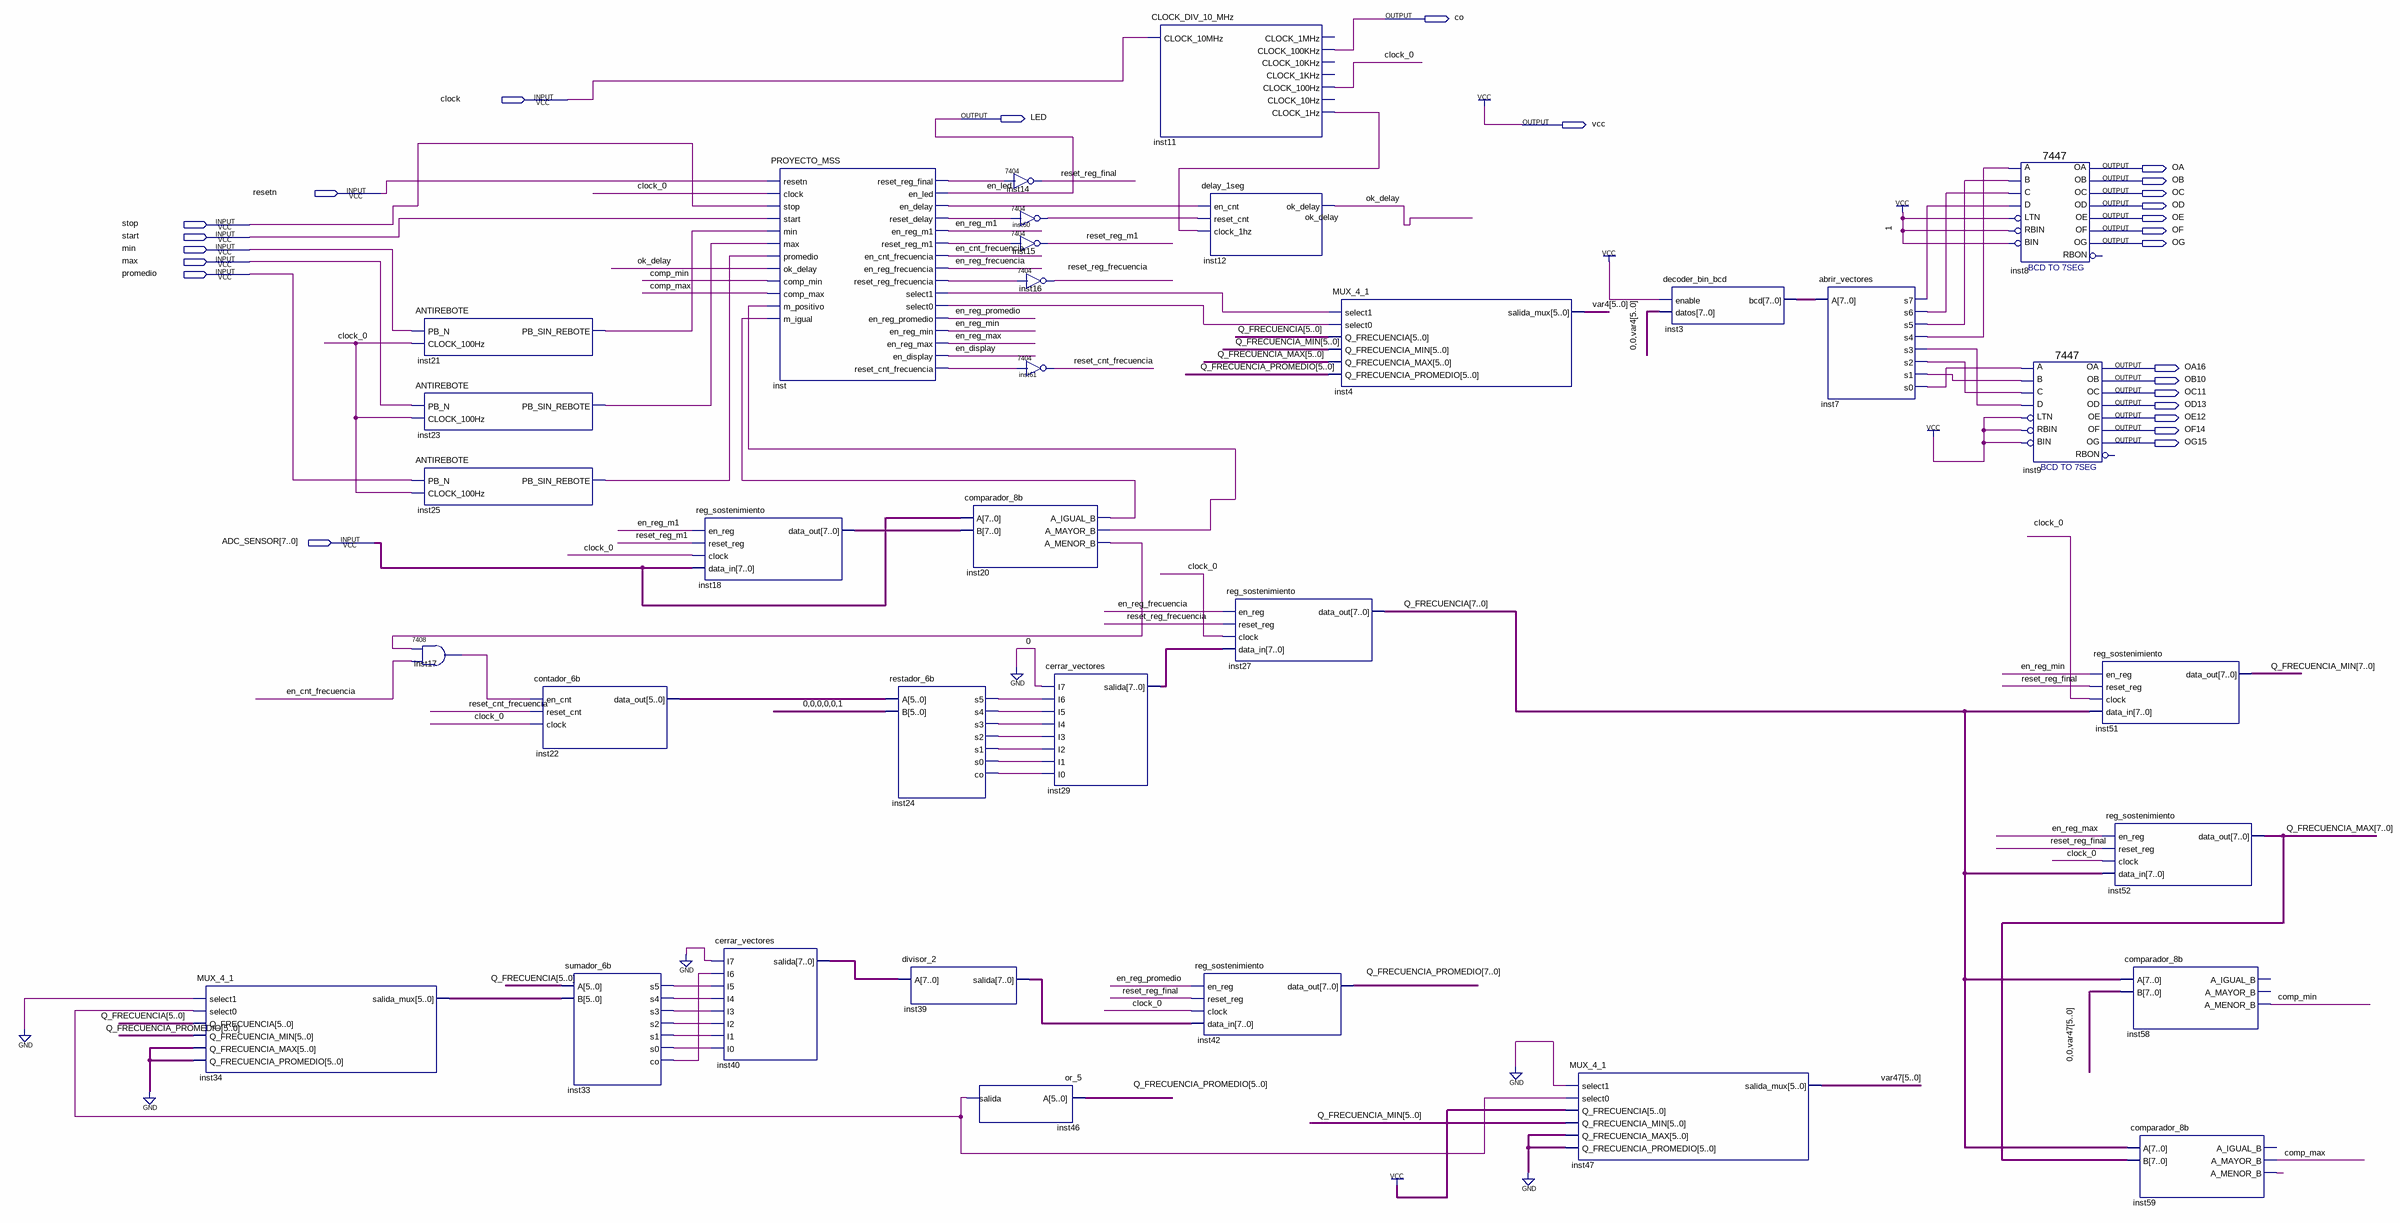
[diagram p0: schematic sheet]
// Quartus schematic simulacion_1.bdf as structural Verilog: 34 symbols, 25 pins
module simulacion_1 (
  input  clock,
  input  resetn,
  input  stop,
  input  start,
  input  min,
  input  max,
  input  promedio,
  input  [7:0] ADC_SENSOR,
  output co,
  output LED,
  output vcc,
  output OA,
  output OB,
  output OC,
  output OD,
  output OE,
  output OF,
  output OG,
  output OA16,
  output OB10,
  output OC11,
  output OD13,
  output OE12,
  output OF14,
  output OG15
);

  wire clock_0, comp_max, comp_min, en_cnt_frecuencia, en_display, en_reg_frecuencia, en_reg_m1, en_reg_max,
       en_reg_min, en_reg_promedio, inst7_s0, inst7_s1, inst7_s2, inst7_s3, inst7_s4, inst7_s5, inst7_s6,
       inst7_s7, inst11_clock_1hz, inst17_1, inst20_a_igual_b, inst20_a_mayor_b, inst20_a_menor_b,
       inst21_pb_sin_rebote, inst23_pb_sin_rebote, inst24_co, inst24_s0, inst24_s1, inst24_s2, inst24_s3,
       inst24_s4, inst24_s5, inst25_pb_sin_rebote, inst33_co, inst33_s0, inst33_s1, inst33_s2, inst33_s3,
       inst33_s4, inst33_s5, inst46_salida, inst59_a_menor_b, inst60_1, inst_en_delay,
       inst_reset_cnt_frecuencia, inst_reset_delay, inst_reset_reg_final, inst_reset_reg_frecuencia,
       inst_reset_reg_m1, inst_select0, inst_select1, ok_delay, reset_cnt_frecuencia, reset_reg_final,
       reset_reg_frecuencia, reset_reg_m1;
  wire [5:0] inst22_data_out, inst34_salida_mux, var4, var47;
  wire [7:0] inst3_bcd, inst18_data_out, inst29_salida, inst39_salida, inst40_salida, Q_FRECUENCIA,
       Q_FRECUENCIA_MAX, Q_FRECUENCIA_MIN, Q_FRECUENCIA_PROMEDIO;

  MUX_4_1 inst34 (
    .select1(1'b0), .select0(inst46_salida), .Q_FRECUENCIA(Q_FRECUENCIA[5:0]),
    .Q_FRECUENCIA_MIN(Q_FRECUENCIA_PROMEDIO[5:0]), .Q_FRECUENCIA_MAX({6{1'b0}}),
    .Q_FRECUENCIA_PROMEDIO({6{1'b0}}), .salida_mux(inst34_salida_mux));
  ANTIREBOTE inst21 (.PB_N(min), .CLOCK_100Hz(clock_0), .PB_SIN_REBOTE(inst21_pb_sin_rebote));
  ANTIREBOTE inst23 (.PB_N(max), .CLOCK_100Hz(clock_0), .PB_SIN_REBOTE(inst23_pb_sin_rebote));
  ANTIREBOTE inst25 (.PB_N(promedio), .CLOCK_100Hz(clock_0), .PB_SIN_REBOTE(inst25_pb_sin_rebote));
  \7408  inst17 (.\3 (en_cnt_frecuencia), .\2 (inst20_a_menor_b), .\1 (inst17_1));
  contador_6b inst22 (.en_cnt(inst17_1), .reset_cnt(reset_cnt_frecuencia), .clock(clock_0), .data_out(inst22_data_out));
  sumador_6b inst33 (
    .A(Q_FRECUENCIA[5:0]), .B(inst34_salida_mux), .s5(inst33_s5), .s4(inst33_s4), .s3(inst33_s3),
    .s2(inst33_s2), .s1(inst33_s1), .s0(inst33_s0), .co(inst33_co));
  reg_sostenimiento inst18 (
    .en_reg(en_reg_m1), .reset_reg(reset_reg_m1), .clock(clock_0), .data_in(ADC_SENSOR),
    .data_out(inst18_data_out));
  cerrar_vectores inst40 (
    .I7(1'b0), .I6(inst33_co), .I5(inst33_s5), .I4(inst33_s4), .I3(inst33_s3), .I2(inst33_s2),
    .I1(inst33_s1), .I0(inst33_s0), .salida(inst40_salida));
  PROYECTO_MSS inst (
    .resetn(resetn), .clock(clock_0), .stop(stop), .start(start), .min(inst21_pb_sin_rebote),
    .max(inst23_pb_sin_rebote), .promedio(inst25_pb_sin_rebote), .ok_delay(ok_delay), .comp_min(comp_min),
    .comp_max(comp_max), .m_positivo(inst20_a_mayor_b), .m_igual(inst20_a_igual_b),
    .reset_reg_final(inst_reset_reg_final), .en_led(LED), .en_delay(inst_en_delay),
    .reset_delay(inst_reset_delay), .en_reg_m1(en_reg_m1), .reset_reg_m1(inst_reset_reg_m1),
    .en_cnt_frecuencia(en_cnt_frecuencia), .en_reg_frecuencia(en_reg_frecuencia),
    .reset_reg_frecuencia(inst_reset_reg_frecuencia), .select1(inst_select1), .select0(inst_select0),
    .en_reg_promedio(en_reg_promedio), .en_reg_min(en_reg_min), .en_reg_max(en_reg_max),
    .en_display(en_display), .reset_cnt_frecuencia(inst_reset_cnt_frecuencia));
  restador_6b inst24 (
    .A(inst22_data_out), .B(6'b000001), .s5(inst24_s5), .s4(inst24_s4), .s3(inst24_s3), .s2(inst24_s2),
    .s1(inst24_s1), .s0(inst24_s0), .co(inst24_co));
  divisor_2 inst39 (.A(inst40_salida), .salida(inst39_salida));
  \7404  inst14 (.\2 (inst_reset_reg_final), .\1 (reset_reg_final));
  comparador_8b inst20 (
    .A(ADC_SENSOR), .B(inst18_data_out), .A_IGUAL_B(inst20_a_igual_b), .A_MAYOR_B(inst20_a_mayor_b),
    .A_MENOR_B(inst20_a_menor_b));
  or_5 inst46 (.A(Q_FRECUENCIA_PROMEDIO[5:0]), .salida(inst46_salida));
  \7404  inst60 (.\2 (inst_reset_delay), .\1 (inst60_1));
  \7404  inst15 (.\2 (inst_reset_reg_m1), .\1 (reset_reg_m1));
  \7404  inst16 (.\2 (inst_reset_reg_frecuencia), .\1 (reset_reg_frecuencia));
  \7404  inst61 (.\2 (inst_reset_cnt_frecuencia), .\1 (reset_cnt_frecuencia));
  cerrar_vectores inst29 (
    .I7(1'b0), .I6(inst24_s5), .I5(inst24_s4), .I4(inst24_s3), .I3(inst24_s2), .I2(inst24_s1),
    .I1(inst24_s0), .I0(inst24_co), .salida(inst29_salida));
  CLOCK_DIV_10_MHz inst11 (
    .CLOCK_10MHz(clock), .CLOCK_100KHz(co), .CLOCK_100Hz(clock_0), .CLOCK_1Hz(inst11_clock_1hz));  // open: CLOCK_1MHz, CLOCK_10KHz, CLOCK_1KHz, CLOCK_10Hz
  delay_1seg inst12 (.en_cnt(inst_en_delay), .reset_cnt(inst60_1), .clock_1hz(inst11_clock_1hz), .ok_delay(ok_delay));
  reg_sostenimiento inst42 (
    .en_reg(en_reg_promedio), .reset_reg(reset_reg_final), .clock(clock_0), .data_in(inst39_salida),
    .data_out(Q_FRECUENCIA_PROMEDIO));
  reg_sostenimiento inst27 (
    .en_reg(en_reg_frecuencia), .reset_reg(reset_reg_frecuencia), .clock(clock_0), .data_in(inst29_salida),
    .data_out(Q_FRECUENCIA));
  MUX_4_1 inst4 (
    .select1(inst_select1), .select0(inst_select0), .Q_FRECUENCIA(Q_FRECUENCIA[5:0]),
    .Q_FRECUENCIA_MIN(Q_FRECUENCIA_MIN[5:0]), .Q_FRECUENCIA_MAX(Q_FRECUENCIA_MAX[5:0]),
    .Q_FRECUENCIA_PROMEDIO(Q_FRECUENCIA_PROMEDIO[5:0]), .salida_mux(var4));
  MUX_4_1 inst47 (
    .select1(1'b0), .select0(inst46_salida), .Q_FRECUENCIA({6{1'b1}}),
    .Q_FRECUENCIA_MIN(Q_FRECUENCIA_MIN[5:0]), .Q_FRECUENCIA_MAX({6{1'b0}}),
    .Q_FRECUENCIA_PROMEDIO({6{1'b0}}), .salida_mux(var47));
  decoder_bin_bcd inst3 (.enable(1'b1), .datos({2'b00, var4}), .bcd(inst3_bcd));
  abrir_vectores inst7 (
    .A(inst3_bcd), .s7(inst7_s7), .s6(inst7_s6), .s5(inst7_s5), .s4(inst7_s4), .s3(inst7_s3), .s2(inst7_s2),
    .s1(inst7_s1), .s0(inst7_s0));
  \7447  inst8 (
    .LTN(1'b1), .B(inst7_s5), .C(inst7_s6), .D(inst7_s7), .RBIN(1'b1), .BIN(1'b1), .A(inst7_s4), .OB(OB),
    .OC(OC), .OE(OE), .OD(OD), .OF(OF), .OG(OG), .OA(OA));  // open: RBON
  \7447  inst9 (
    .LTN(1'b1), .B(inst7_s1), .C(inst7_s2), .D(inst7_s3), .RBIN(1'b1), .BIN(1'b1), .A(inst7_s0), .OB(OB10),
    .OC(OC11), .OE(OE12), .OD(OD13), .OF(OF14), .OG(OG15), .OA(OA16));  // open: RBON
  reg_sostenimiento inst51 (
    .en_reg(en_reg_min), .reset_reg(reset_reg_final), .clock(clock_0), .data_in(Q_FRECUENCIA),
    .data_out(Q_FRECUENCIA_MIN));
  reg_sostenimiento inst52 (
    .en_reg(en_reg_max), .reset_reg(reset_reg_final), .clock(clock_0), .data_in(Q_FRECUENCIA),
    .data_out(Q_FRECUENCIA_MAX));
  comparador_8b inst58 (.A(Q_FRECUENCIA), .B({2'b00, var47}), .A_MENOR_B(comp_min));  // open: A_IGUAL_B, A_MAYOR_B
  comparador_8b inst59 (
    .A(Q_FRECUENCIA), .B(Q_FRECUENCIA_MAX), .A_MAYOR_B(comp_max), .A_MENOR_B(inst59_a_menor_b));  // open: A_IGUAL_B

  assign vcc = 1'b1;

  // Other names for the same wires on the sheet: en_led = LED
endmodule
